# Altium schematic sheet MCU_MKE185F512VLH16.SchDoc: Microcontroller
size A4; DrawnBy: Alvin Ha; DocumentNumber: MCU2018-2; Revision: 2.0; SheetNumber: 2; SheetTotal: 4
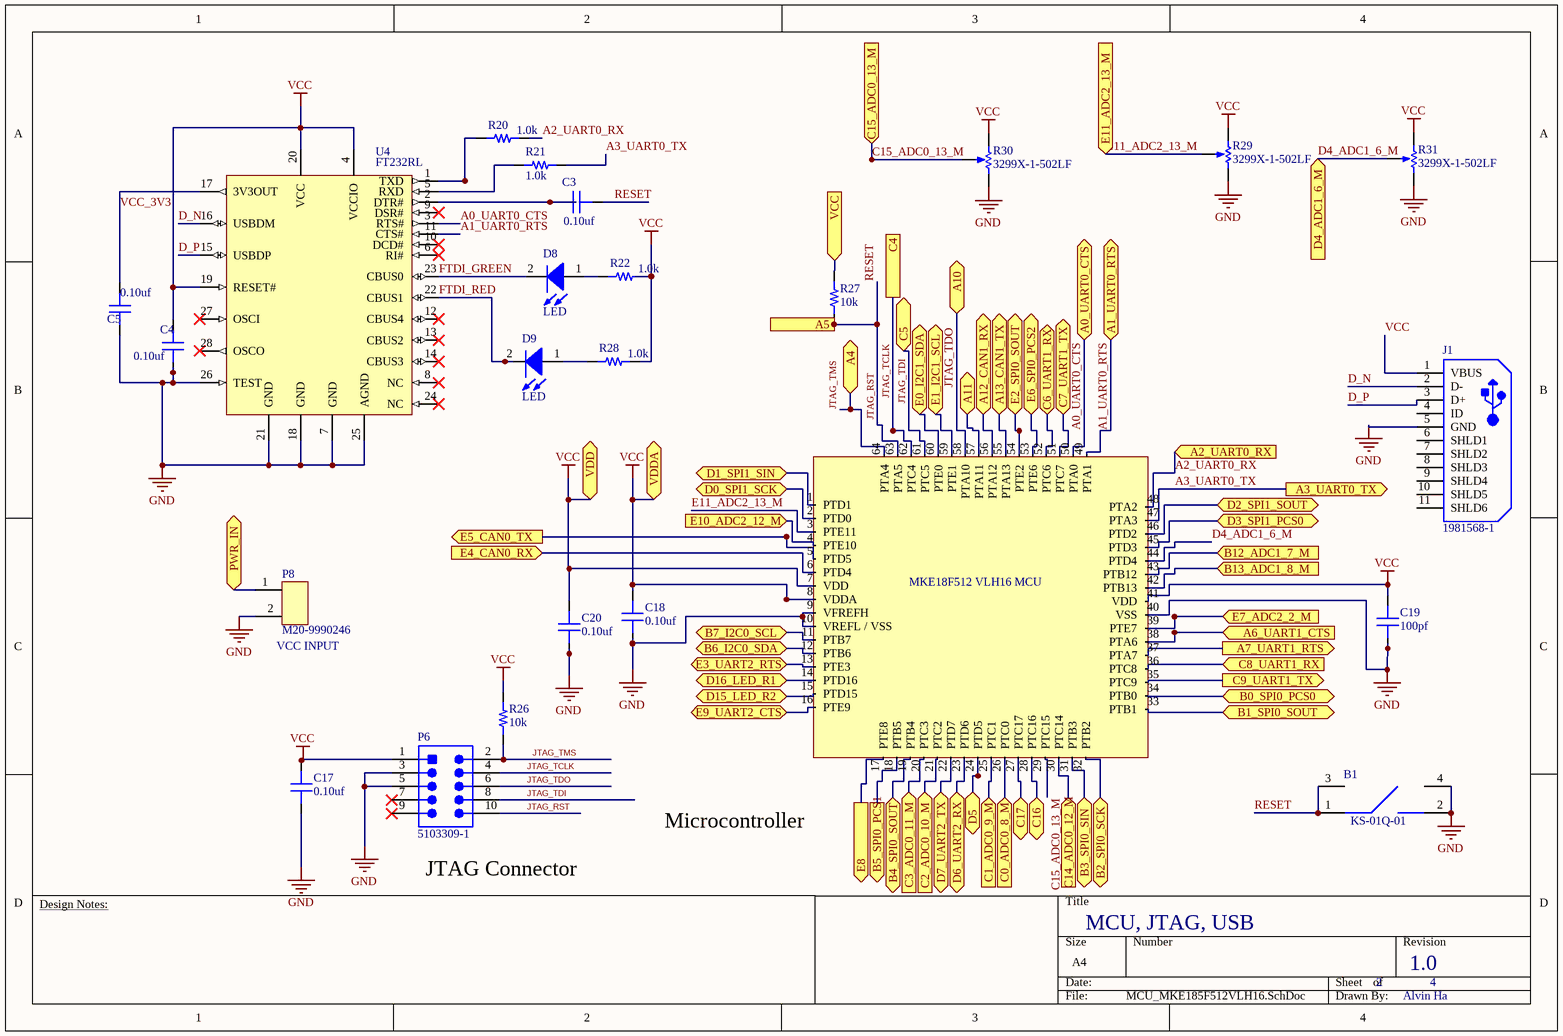
[diagram p0: MCU_MKE185F512VLH16.SchDoc]

## Parts
B1  KS-01Q-01  [KS-01Q-01]
C3  value 0.10uf  [CAP 0603/1608]  (hidden comment: Capacitor MLCC 0.10uf 25V CAP 0603/1608)
C4  value 0.10uf  [CAP 0603/1608]  (hidden comment: Capacitor MLCC 0.10uf 25V CAP 0603/1608)
C5  value 0.10uf  [CAP 0603/1608]  (hidden comment: Capacitor MLCC 0.10uf 25V CAP 0603/1608)
C17  value 0.10uf  [CAP 0603/1608]  (hidden comment: Capacitor MLCC 0.10uf 16V CAP 0603/1608)
C18  value 0.10uf  [CAP 0603/1608]  (hidden comment: Capacitor MLCC 0.10uf 25V CAP 0603/1608)
C19  value 100pf  [CAP 0603/1608]  (hidden comment: Capacitor MLCC 100pf 25V CAP 0603/1608)
C20  value 0.10uf  [CAP 0603/1608]  (hidden comment: Capacitor MLCC 0.10uf 25V CAP 0603/1608)
D8  LED  [0805_LED]
D9  LED  [0805_LED]
J1  1981568-1  [TECO-1981568-5_V]
P6  5103309-1  [HDR2X5_SMT]
P8  M20-9990246  [M20-9990246]
R20  value 1.0k  [RES 0805/2012]  (hidden comment: Resistor 1.0k 0805 1/4W 1%)
R21  value 1.0k  [RES 0805/2012]  (hidden comment: Resistor 1.0k 0805 1/4W 1%)
R22  value 1.0k  [RES 0805/2012]  (hidden comment: Resistor 1.0k 0805 1/4W 1%)
R26  value 10k  [RES 0603/1608]  (hidden comment: Resistor 10k 0603 1/10W 1%)
R27  value 10k  [RES 0603/1608]  (hidden comment: Resistor 10k 0603 1/10W 5%)
R28  value 1.0k  [RES 0805/2012]  (hidden comment: Resistor 1.0k 0805 1/4W 1%)
R29  3299X-1-502LF  [3299X-1-502LF]
R30  3299X-1-502LF  [3299X-1-502LF]
R31  3299X-1-502LF  [3299X-1-502LF]
U3  MKE18F512 VLH16 MCU  [TQFP64]
U4  FT232RL  [SSOP-28]

## Ports
A0_UART0_CTS (bidir), A1_UART0_RTS (bidir), A2_UART0_RX (in), A3_UART0_TX (out), A4 (bidir), A5, A6_UART1_CTS (in), A7_UART1_RTS (out), A10 (bidir), A11 (bidir), A12_CAN1_RX (bidir), A13_CAN1_TX (bidir), B0_SPI0_PCS0 (bidir), B1_SPI0_SOUT (bidir), B2_SPI0_SCK (bidir), B3_SPI0_SIN (bidir), B4_SPI0_SOUT (bidir), B5_SPI0_PCS1 (out), B6_I2C0_SDA (bidir), B7_I2C0_SCL (bidir), B12_ADC1_7_M (in), B13_ADC1_8_M (in), C0_ADC0_8_M (in), C1_ADC0_9_M (in), C2_ADC0_10_M (in), C3_ADC0_11_M (in), C4, C5 (bidir), C6_UART1_RX (bidir), C7_UART1_TX (bidir), C8_UART1_RX (in), C9_UART1_TX (out), C14_ADC0_12_M (in), C15_ADC0_13_M (in), C16 (bidir), C17 (bidir), D0_SPI1_SCK (bidir), D1_SPI1_SIN (bidir), D2_SPI1_SOUT (bidir), D3_SPI1_PCS0 (bidir), D4_ADC1_6_M (in), D5 (bidir), D6_UART2_RX (bidir), D7_UART2_TX (bidir), D15_LED_R2 (bidir), D16_LED_R1 (bidir), E0_I2C1_SDA (bidir), E1_I2C1_SCL (bidir), E2_SPI0_SOUT (bidir), E3_UART2_RTS (bidir), E4_CAN0_RX (in), E5_CAN0_TX (out), E6_SPI0_PCS2 (bidir), E7_ADC2_2_M (in), E8 (out), E9_UART2_CTS (bidir), E10_ADC2_12_M (in), E11_ADC2_13_M (in), PWR_IN (bidir), VCC (in), VDD (bidir), VDDA (bidir)

## Nets
GND: B1.2 B1.4 C4.1 C5.1 C17.1 C18.1 C19.1 C20.1 J1.5(GND) P6.3 P6.5 R29.3(BOT) R30.3(BOT) R31.3(BOT) U3.9(VFREFH) U3.10(VREFL_/_VSS) U3.40(VSS) U4.7(GND) U4.18(GND) U4.21(GND) U4.25(AGND) U4.26(TEST)
VCC: C4.2 C17.2 C18.2 C19.2 C20.2 J1.1(VBUS) P6.1 R22.2 R26.2 R28.2 R29.1(TOP) R30.1(TOP) R31.1(TOP) U3.7(VDD) U3.8(VDDA) U3.41(VDD) U4.4(VCCIO) U4.19(RESET#) U4.20(VCC) ; port VDDA, port VDD
A0_UART0_CTS: U3.50(PTA0) U4.3(RTS#) ; port A0_UART0_CTS
A1_UART0_RTS: U3.49(PTA1) U4.11(CTS#) ; port A1_UART0_RTS
A2_UART0_RX: R20.2 U3.48(PTA2) ; port A2_UART0_RX
A3_UART0_TX: R21.2 U3.47(PTA3) ; port A3_UART0_TX
A6_UART1_CTS: U3.38(PTA6) ; port A6_UART1_CTS
A7_UART1_RTS: U3.37(PTA7) ; port A7_UART1_RTS
A11: U3.57(PTA11) ; port A11
A12_CAN1_RX: U3.56(PTA12) ; port A12_CAN1_RX
A13_CAN1_TX: U3.55(PTA13) ; port A13_CAN1_TX
B0_SPI0_PCS0: U3.34(PTB0) ; port B0_SPI0_PCS0
B1_SPI0_SOUT: U3.33(PTB1) ; port B1_SPI0_SOUT
B2_SPI0_SCK: U3.32(PTB2) ; port B2_SPI0_SCK
B3_SPI0_SIN: U3.31(PTB3) ; port B3_SPI0_SIN
B4_SPI0_SOUT: U3.19(PTB4) ; port B4_SPI0_SOUT
B5_SPI0_PCS1: U3.18(PTB5) ; port B5_SPI0_PCS1
B6_I2C0_SDA: U3.12(PTB6) ; port B6_I2C0_SDA
B7_I2C0_SCL: U3.11(PTB7) ; port B7_I2C0_SCL
B12_ADC1_7_M: U3.43(PTB12) ; port B12_ADC1_7_M
B13_ADC1_8_M: U3.42(PTB13) ; port B13_ADC1_8_M
C0_ADC0_8_M: U3.26(PTC0) ; port C0_ADC0_8_M
C1_ADC0_9_M: U3.25(PTC1) ; port C1_ADC0_9_M
C2_ADC0_10_M: U3.21(PTC2) ; port C2_ADC0_10_M
C3_ADC0_11_M: U3.20(PTC3) ; port C3_ADC0_11_M
C6_UART1_RX: U3.52(PTC6) ; port C6_UART1_RX
C7_UART1_TX: U3.51(PTC7) ; port C7_UART1_TX
C8_UART1_RX: U3.36(PTC8) ; port C8_UART1_RX
C9_UART1_TX: U3.35(PTC9) ; port C9_UART1_TX
C14_ADC0_12_M: U3.30(PTC14) ; port C14_ADC0_12_M
C15_ADC0_13_M: R30.2(TAP) U3.29(PTC15) ; port C15_ADC0_13_M
C16: U3.28(PTC16) ; port C16
C17: U3.27(PTC17) ; port C17
D0_SPI1_SCK: U3.2(PTD0) ; port D0_SPI1_SCK
D1_SPI1_SIN: U3.1(PTD1) ; port D1_SPI1_SIN
D2_SPI1_SOUT: U3.46(PTD2) ; port D2_SPI1_SOUT
D3_SPI1_PCS0: U3.45(PTD3) ; port D3_SPI1_PCS0
D4_ADC1_6_M: R31.2(TAP) U3.44(PTD4) ; port D4_ADC1_6_M
D5: U3.24(PTD5) ; port D5
D6_UART2_RX: U3.23(PTD6) ; port D6_UART2_RX
D7_UART2_TX: U3.22(PTD7) ; port D7_UART2_TX
D15_LED_R2: U3.15(PTD15) ; port D15_LED_R2
D16_LED_R1: U3.14(PTD16) ; port D16_LED_R1
D_N: J1.2(D-) U4.16(USBDM)
D_P: J1.3(D+) U4.15(USBDP)
E0_I2C1_SDA: U3.60(PTE0) ; port E0_I2C1_SDA
E1_I2C1_SCL: U3.59(PTE1) ; port E1_I2C1_SCL
E2_SPI0_SOUT: U3.54(PTE2) ; port E2_SPI0_SOUT
E3_UART2_RTS: U3.13(PTE3) ; port E3_UART2_RTS
E4_CAN0_RX: U3.6(PTD4) ; port E4_CAN0_RX
E5_CAN0_TX: U3.5(PTD5) ; port E5_CAN0_TX
E6_SPI0_PCS2: U3.53(PTE6) ; port E6_SPI0_PCS2
E7_ADC2_2_M: U3.39(PTE7) ; port E7_ADC2_2_M
E8: U3.17(PTE8) ; port E8
E9_UART2_CTS: U3.16(PTE9) ; port E9_UART2_CTS
E10_ADC2_12_M: U3.4(PTE10) ; port E10_ADC2_12_M
E11_ADC2_13_M: R29.2(TAP) U3.3(PTE11) ; port E11_ADC2_13_M
FTDI_GREEN: D8.2(K) U4.23(CBUS0)
FTDI_RED: D9.2(K) U4.22(CBUS1)
JTAG_RST: B1.1 B1.3 C3.2 P6.10 R27.1 U3.63(PTA5) ; port A5  [also labelled RESET]
JTAG_TCLK: P6.4 U3.62(PTC4) ; port C4
JTAG_TDI: P6.8 U3.61(PTC5) ; port C5
JTAG_TDO: P6.6 U3.58(PTA10) ; port A10
JTAG_TMS: P6.2 R26.1 U3.64(PTA4) ; port A4
PWR_IN: P8.1 ; port PWR_IN
VCC: R27.2 ; port VCC  [a separate net that carries the same name]
VCC_3V3: C5.2 U4.17(3V3OUT)
NetC3_1: C3.1 U4.2(DTR#)
NetD8_1: D8.1(A) R22.1
NetD9_1: D9.1(A) R28.1
NetR20_1: R20.1 U4.1(TXD)
NetR21_1: R21.1 U4.5(RXD)

Not connected (* = marked no-connect by the designer): J1 4(ID) 6(SHLD1) 7(SHLD2) 8(SHLD3) 9(SHLD4) 10(SHLD5) 11(SHLD6); P6 7* 9*; P8 2; U4 6(RI#)* 8(NC)* 9(DSR#)* 10(DCD#)* 12(CBUS4)* 13(CBUS2)* 14(CBUS3)* 24(NC)* 27(OSCI)* 28(OSCO)*

## Notes on the sheet
- (near P8) VCC INPUT
- (near U3) Microcontroller
- (near P6) JTAG Connector
- MCU, JTAG, USB
- 1.0
- Design Notes:

## Library data of the parts
B1 = 7: RESET button; Manufacturer_id: 1; idTable: 7; Value: NULL; Num_Contacts: 4; Num_Rows: 2; Pitch: 5; Created_By: Austin; Drawer_id: 1; Name: KS-01Q-01; Voltage_Rating: Null; Package: NULL; MfrPartNo: KS-01Q-01; Link: https://www.digikey.com/product-detail/en/e-switch/KS-01Q-01/EG4791-ND/2116270; ComponentLink1Description: null; ComponentLink1URL: Null; Supplier1: e-switch; Supplier1PartNo: EG4791-ND; Created_Date: 12/15/2018; Updated_By: Null
C3-C5 C18 C20 = 583: Manufacturer_id: 1; idCapacitor: 583; Name: Cap_0.10uf_25V_CAP 0603/1608; Dielectric: Ceramic; Created_By: Nick Mah; Drawer_id: 1; Voltage_Rating: 25V; Package: CAP 0603/1608; Created_Date: 10/20/2018
C17 = 223: Manufacturer_id: 1; idCapacitor: 223; Name: Cap_0.10uf_16V_CAP 0603/1608; Dielectric: Ceramic; Created_By: Nick Mah; Drawer_id: 1; Voltage_Rating: 16V; Package: CAP 0603/1608; Created_Date: 10/20/2018
C19 = 529: Manufacturer_id: 1; idCapacitor: 529; Name: Cap_100pf_25V_CAP 0603/1608; Dielectric: Ceramic; Created_By: Nick Mah; Drawer_id: 1; Voltage_Rating: 25V; Package: CAP 0603/1608; Created_Date: 10/20/2018
D8 = 2: Manufacturer_id: 1; idLED: 2; Name: CMD17_0805_GREEN; Value: Green; Brightness: 7mcd; Id: 20mA; Vf: 2.1V; Drawer_id: 1; Link: https://www.digikey.com/product-detail/en/visual-communications-company-vcc/CMD17-21VGD-TR8/L62505CT-ND/254936; Package: 0805
D9 = 1: idLED: 1; Name: LED_0805_RED; Value: Red; Vf: 0.7V; Manufacturer_id: 1; Drawer_id: 1; Package: 0805
J1 = 5: USB Micro Type B; Manufacturer_id: 1; idConn: 5; Name: TE USB Micro; Value: CONN; Created_By: Aiku; MfrPartNo: 1981568-1; Drawer_id: 1; Num_Contacts: 5; Link: https://www.mouser.com/ProductDetail/TE-Connectivity-AMP/1981568-1?qs=sGAEpiMZZMulM8LPOQ%252bykzEIUPbUCiSfqsfxH3Oq%252bYo%3d; ComponentLink1Description: Datasheet; Supplier1: TE; Created_Date: 10/20/2018
P6 = 4: 2 row connector; Manufacturer_id: 1; idConn: 4; Name: CONN_TE_2X5POS; Value: CONN; Voltage_Rating: None; Num_Contacts: 10; Num_Rows: 2; Pitch: 2.54mm; Created_By: Aiku; Drawer_id: 1; MfrPartNo: 5103309-1; Link: https://www.digikey.com/product-detail/en/5103309-1/A33160-ND/1114898?utm_campaign=buynow&WT.z_cid=ref_octopart_dkc_buynow&utm_medium=aggregator&curr=usd&site=us&utm_source=octopart; ComponentLink1Description: Datasheet
P8 = 25: 2 Pin VCC Power Header, Male; Manufacturer_id: 1; idConn: 25; Value: CONN; Voltage_Rating: Null; Num_Contacts: 2; Pitch: 2.54; Created_By: Austin; Drawer_id: 1; Name: M20-9990246; Num_Rows: Null; Package: Conn; MfrPartNo: M20-9990246; Link: https://www.digikey.com/product-detail/en/harwin-inc/M20-9990246/952-2262-ND/3728226; ComponentLink1Description: Null; ComponentLink1URL: https://www.digikey.com/product-detail/en/harwin-inc/M20-9990246/952-2262-ND/3728226; Supplier1: Digi-Key; Supplier1PartNo: 952-2262-ND; Created_Date: 12/15/2018; Updated_By: Null
R20-R22 R28 = 721: Manufacturer_id: 1; idResistor: 721; Name: Res_1.0k_0805_1/4W_1%; Created_By: Nick Mah; Supplier 1: Digi-Key; Drawer_id: 1; Tolerance: 1%; Power: 1/4W; Package: 0805; ComponentLink1Description: Datasheet; Created_Date: 2018-10-20
R26 = 313: Manufacturer_id: 1; idResistor: 313; Name: Res_10k_0603_1/10W_1%; Created_By: Nick Mah; Supplier 1: Digi-Key; Drawer_id: 1; Tolerance: 1%; Power: 1/10W; Package: 0603; ComponentLink1Description: Datasheet; Created_Date: 2018-10-20
R27 = 1393: Manufacturer_id: 1; idResistor: 1393; Name: Res_10k_0603_1/10W_5%; Created_By: Nick Mah; Supplier 1: Digi-Key; Drawer_id: 1; Tolerance: 5%; Power: 1/10W; Package: 0603; ComponentLink1Description: Datasheet; Created_Date: 2018-10-20
R29-R31 = 6: Manufacturer_id: 1; idTable: 6; Value: 5K; Num_Contacts: 3; Pitch: 2.54mm; Drawer_id: 1; Name: 3299X-1-502LF; MfrPartNo: 3299X-1-502LF; Link: https://www.digikey.com/product-detail/en/bourns-inc/3299X-1-502LF/3299X-502LF-ND/1088167; ComponentLink1Description: Datasheet
U3 = 1: idMCU: 1; Manufacturer_id: 1; Drawer_id: 1; Name: MKE18F512VLH16 MCU
U4 = 3: Manufacturer_id: 1; idIC_Interface: 3; Name: USB FTDI; Protocol: UART; Vin(Min): 3.3; Vin(Max): 5.25; Created_By: Kyle; Drawer_id: 1; MfrPartNo: FT232RL; Link: https://www.digikey.com/product-detail/en/ftdi-future-technology-devices-international-ltd/FT232RL-REEL/768-1007-1-ND/1836402